# Altium schematic sheet Precharge and TSAL.SchDoc
size Tabloid; SheetNumber: 3; SheetTotal: 4
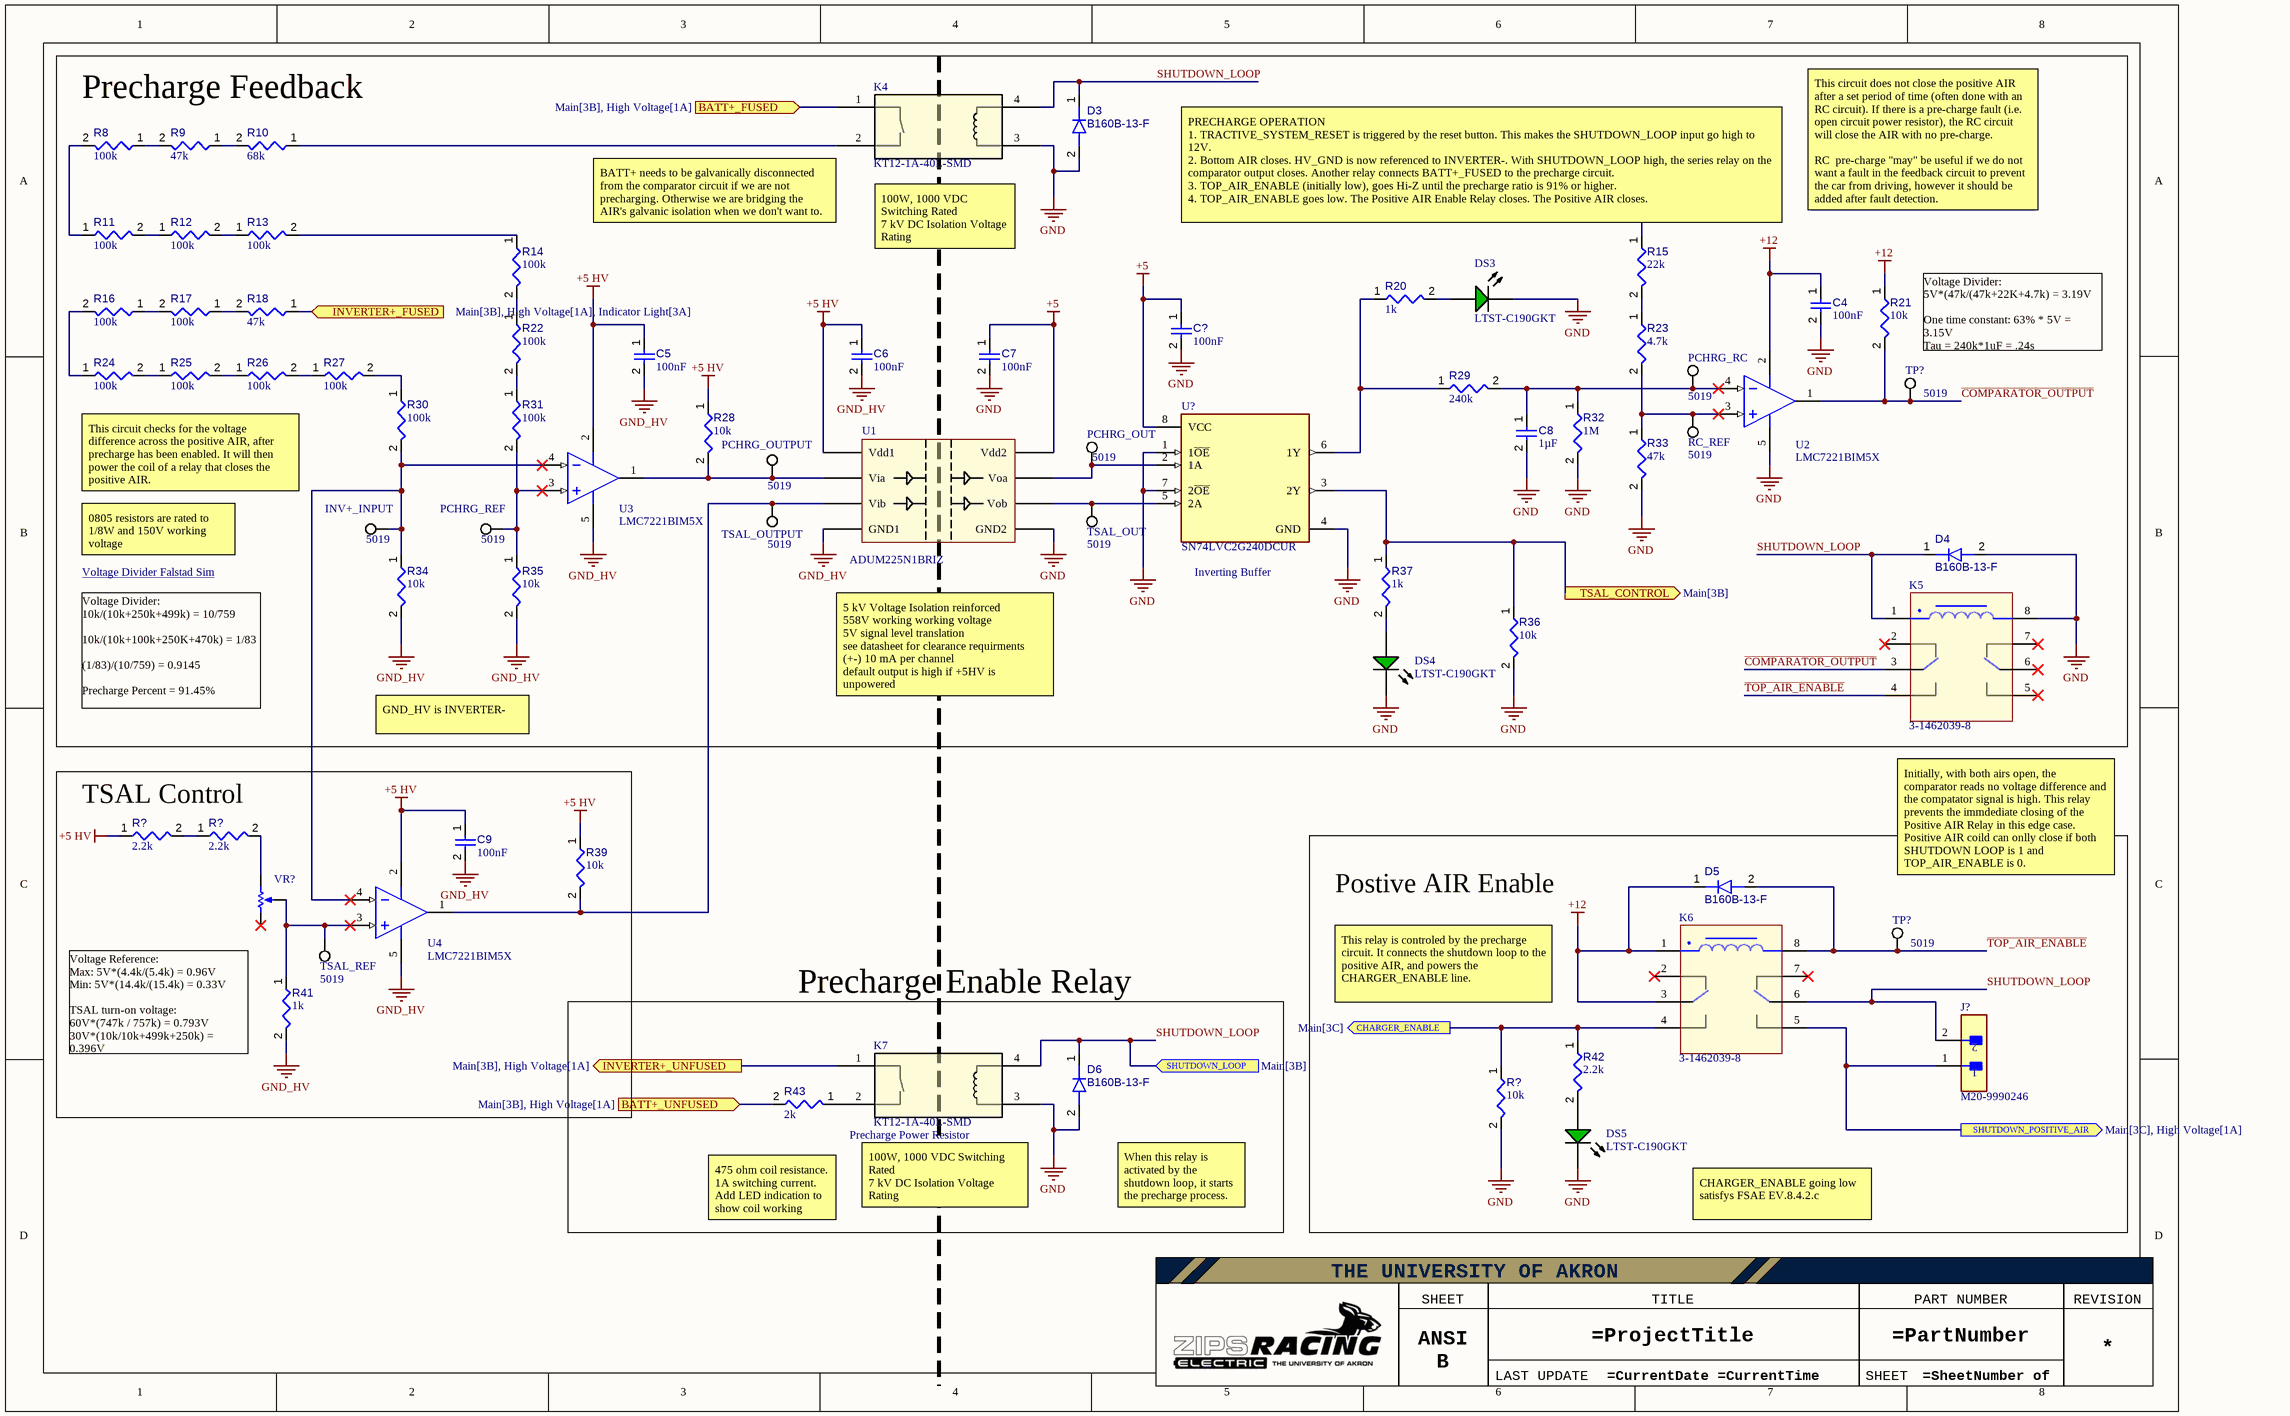
[diagram p0: Precharge and TSAL.SchDoc]

## Parts
(Parts that share a designator on the sheet are numbered #1, #2 ... from top to bottom, then left to right.)
C4  value 100nF  [CAPC1608X90X40NL10T20]  (hidden comment: Capacitor 100 nF +/-10% 50 V 0603)
C5  value 100nF  [CAPC1608X90X40NL10T20]  (hidden comment: Capacitor 100 nF +/-10% 50 V 0603)
C6  value 100nF  [CAPC1608X90X40NL10T20]  (hidden comment: Capacitor 100 nF +/-10% 50 V 0603)
C7  value 100nF  [CAPC1608X90X40NL10T20]  (hidden comment: Capacitor 100 nF +/-10% 50 V 0603)
C8  value 1µF  [CAPC1608X94X35NL15T15]  (hidden comment: Capacitor 1 uF +/- 10% 16 V 0603)
C9  value 100nF  [CAPC1608X90X40NL10T20]  (hidden comment: Capacitor 100 nF +/-10% 50 V 0603)
C?  value 100nF  [CAPC1608X90X40NL10T20]  (hidden comment: Capacitor 100 nF +/-10% 50 V 0603)
D3  B160B-13-F  [FP-SMB-MFG]
D4  B160B-13-F  [FP-SMB-MFG]
D5  B160B-13-F  [FP-SMB-MFG]
D6  B160B-13-F  [FP-SMB-MFG]
DS3  LTST-C190GKT  [LTST-C190GKT_V]
DS4  LTST-C190GKT  [LTST-C190GKT_V]
DS5  LTST-C190GKT  [LTST-C190GKT_V]
INV+_INPUT  5019  [KSTN-5019_V]
J?  M20-9990246  [FP-M20-9990246-MFG]
K4  KT12-1A-40L-SMD  [New footprint 1]
K5  3-1462039-8  [FP-3-1462039-8-MFG]
K6  3-1462039-8  [FP-3-1462039-8-MFG]
K7  KT12-1A-40L-SMD  [New footprint 1]
PCHRG_OUT  5019  [KSTN-5019_V]
PCHRG_OUTPUT  5019  [KSTN-5019_V]
PCHRG_RC  5019  [KSTN-5019_V]
PCHRG_REF  5019  [KSTN-5019_V]
R8  value 100k  [RESC2013X70X40ML20T20]  (hidden comment: Resistor 100k +/-1% 0805 125 mW)
R9  value 47k  [RESC2013X60X35LL10T20]  (hidden comment: Resistor 47k +/- 1 % 0805 125 mW)
R10  value 68k  [RESC2013X70X40NL20T20]  (hidden comment: Resistor 68k +/- 1% 0805 125 mW)
R11  value 100k  [RESC2013X70X40ML20T20]  (hidden comment: Resistor 100k +/-1% 0805 125 mW)
R12  value 100k  [RESC2013X70X40ML20T20]  (hidden comment: Resistor 100k +/-1% 0805 125 mW)
R13  value 100k  [RESC2013X70X40ML20T20]  (hidden comment: Resistor 100k +/-1% 0805 125 mW)
R14  value 100k  [RESC2013X70X40ML20T20]  (hidden comment: Resistor 100k +/-1% 0805 125 mW)
R15  value 22k  [RESC1608X55X25LL10T15]  (hidden comment: Resistor 22k +/- 1% 0603 100 mW)
R16  value 100k  [RESC2013X70X40ML20T20]  (hidden comment: Resistor 100k +/-1% 0805 125 mW)
R17  value 100k  [RESC2013X70X40ML20T20]  (hidden comment: Resistor 100k +/-1% 0805 125 mW)
R18  value 47k  [RESC2013X60X35LL10T20]  (hidden comment: Resistor 47k +/- 1 % 0805 125 mW)
R20  value 1k  [RESC1608X55X25ML10T15]  (hidden comment: Resistor 1k +/-1% 0603 100 mW)
R21  value 10k  [RESC1608X55X25ML10T15]  (hidden comment: Resistor 10k +/-1% 0603 100 mW)
R22  value 100k  [RESC2013X70X40ML20T20]  (hidden comment: Resistor 100k +/-1% 0805 125 mW)
R23  value 4.7k  [RESC1608X55X25ML10T15]  (hidden comment: Resistor 4k7 +/-1% 0603 100 mW)
R24  value 100k  [RESC2013X70X40ML20T20]  (hidden comment: Resistor 100k +/-1% 0805 125 mW)
R25  value 100k  [RESC2013X70X40ML20T20]  (hidden comment: Resistor 100k +/-1% 0805 125 mW)
R26  value 100k  [RESC2013X70X40ML20T20]  (hidden comment: Resistor 100k +/-1% 0805 125 mW)
R27  value 100k  [RESC2013X70X40ML20T20]  (hidden comment: Resistor 100k +/-1% 0805 125 mW)
R28  value 10k  [RESC1608X55X25ML10T15]  (hidden comment: Resistor 10k +/-1% 0603 100 mW)
R29  value 240k  [RESC1608X55X30LL15T15]  (hidden comment: Resistor 240k +/-1% 0603 100 mW)
R30  value 100k  [RESC2013X70X40ML20T20]  (hidden comment: Resistor 100k +/-1% 0805 125 mW)
R31  value 100k  [RESC2013X70X40ML20T20]  (hidden comment: Resistor 100k +/-1% 0805 125 mW)
R32  value 1M  [RESC1608X55X25LL10T15]  (hidden comment: Resistor 1M +/- 1 % 0603 100mW)
R33  value 47k  [FP-RT0603-IPC_C]  (hidden comment: Resistor 47k +/-1% 0603 100 mW)
R34  value 10k  [RESC2013X50X35ML15T15]  (hidden comment: Resistor 10k +/-1% 0805 125 mW)
R35  value 10k  [RESC2013X50X35ML15T15]  (hidden comment: Resistor 10k +/-1% 0805 125 mW)
R36  value 10k  [RESC1608X55X25ML10T15]  (hidden comment: Resistor 10k +/-1% 0603 100 mW)
R37  value 1k  [RESC1608X55X25ML10T15]  (hidden comment: Resistor 1k +/-1% 0603 100 mW)
R39  value 10k  [RESC1608X55X25ML10T15]  (hidden comment: Resistor 10k +/-1% 0603 100 mW)
R41  value 1k  [RESC1608X55X25ML10T15]  (hidden comment: Resistor 1k +/-1% 0603 100 mW)
R42  value 2.2k  [RESC1608X55X25LL10T15]  (hidden comment: Resistor 2.2k +/-1% 0603 100mW)
R43  value 2k  [HSA252K0J-Footprint-1]  (hidden comment: HSA252K0J)
R?#1  value 2.2k  [RESC1608X55X25LL10T15]  (hidden comment: Resistor 2.2k +/-1% 0603 100mW)
R?#2  value 2.2k  [RESC1608X55X25LL10T15]  (hidden comment: Resistor 2.2k +/-1% 0603 100mW)
R?#3  value 10k  [RESC1608X55X25ML10T15]  (hidden comment: Resistor 10k +/-1% 0603 100 mW)
RC_REF  5019  [KSTN-5019_V]
TP?#1  5019  [KSTN-5019_V]
TP?#2  5019  [KSTN-5019_V]
TSAL_OUT  5019  [KSTN-5019_V]
TSAL_OUTPUT  5019  [KSTN-5019_V]
TSAL_REF  5019  [KSTN-5019_V]
U1  ADUM225N1BRIZ  [SOIC127P1030X265-8N]
U2  LMC7221BIM5X  [DBV0005A_L]
U3  LMC7221BIM5X  [DBV0005A_L]
U4  LMC7221BIM5X  [DBV0005A_L]
U?  SN74LVC2G240DCUR  [FP-DCU0008A-IPC_B]
VR?  3362P-1-103LF  [BOUR-3362P]  (value not drawn)

## Blocks framed on the sheet
Precharge Feedback: C4-C8 C? D3 D4 DS3 DS4 INV+_INPUT K4 K5 PCHRG_OUT PCHRG_OUTPUT PCHRG_RC PCHRG_REF R8-R18 R20-R37 RC_REF TP?#1 TSAL_OUT TSAL_OUTPUT U1-U3 U?
TSAL Control: C9 R39 R41 R?#1 R?#2 TSAL_REF U4 VR?
Postive AIR Enable: D5 DS5 J? K6 R42 R?#3 TP?#2
Precharge Enable Relay: D6 K7 R43

## Ports
BATT+_FUSED (in, see Main[3B], High Voltage[1A]), BATT+_UNFUSED (in, see Main[3B], High Voltage[1A]), CHARGER_ENABLE (out, see Main[3C]), INVERTER+_FUSED (in, see Main[3B], High Voltage[1A], Indicator Light[3A]), INVERTER+_UNFUSED (out, see Main[3B], High Voltage[1A]), SHUTDOWN_LOOP (in, see Main[3B]), SHUTDOWN_POSITIVE_AIR (out, see Main[3C], High Voltage[1A]), TSAL_CONTROL (out, see Main[3B])

## Nets
+5: C7.1 C?.1 R15.1 U1.8(Vdd2) U?.8(VCC)
+5 HV: C5.1 C6.1 C9.1 R28.1 R39.1 R?#1.1 U1.1(Vdd1) U3.2(V+) U4.2(V+)
+12: C4.1 D5.1(K) K6.1 K6.3 R21.1 U2.2(V+)
GND: C4.2 C7.2 C8.2 C?.2 D3.2(A) D4.2(A) D6.2(A) DS3.2(K) DS4.2(K) DS5.2(K) K4.3 K5.8 K7.3 R32.2 R33.2 R36.2 R?#3.2 U1.5(GND2) U2.5(V-) U?.1(1~{OE}) U?.4(GND) U?.7(2~{OE})
GND_HV: C5.2 C6.2 C9.2 R34.2 R35.2 R41.2 U1.4(GND1) U3.5(V-) U4.5(V-)
~{COMPARATOR_OUTPUT}: K5.3 R21.2 TP?#1.1 U2.1(OUT)
~{TOP_AIR_ENABLE}: D5.2(A) K5.4 K6.8 TP?#2.1
BATT+_FUSED: K4.1 ; port BATT+_FUSED
BATT+_UNFUSED: R43.2 ; port BATT+_UNFUSED
CHARGER_ENABLE: K6.4 R42.1 R?#3.1 ; port CHARGER_ENABLE
INVERTER+_FUSED: R18.1 ; port INVERTER+_FUSED
INVERTER+_UNFUSED: K7.1 ; port INVERTER+_UNFUSED
SHUTDOWN_LOOP: D3.1(K) D4.1(K) D6.1(K) J?.2 K4.4 K5.1 K6.6 K7.4 ; port SHUTDOWN_LOOP
SHUTDOWN_POSITIVE_AIR: J?.1 K6.5 ; port SHUTDOWN_POSITIVE_AIR
TSAL_CONTROL: R36.1 R37.1 U?.3(2Y) ; port TSAL_CONTROL
NetC8_1: C8.1 PCHRG_RC.1 R29.2 R32.1 U2.4(IN-)
NetDS3_1: DS3.1(A) R20.2
NetDS4_1: DS4.1(A) R37.2
NetDS5_1: DS5.1(A) R42.2
NetINV+_INPUT_1: INV+_INPUT.1 R30.2 R34.1 U3.4(IN-) U4.4(IN-)
NetK4_2: K4.2 R10.1
NetK7_2: K7.2 R43.1
NetPCHRG_OUT_1: PCHRG_OUT.1 U1.7(Voa) U?.2(1A)
NetPCHRG_OUTPUT_1: PCHRG_OUTPUT.1 R28.2 U1.2(Via) U3.1(OUT)
NetPCHRG_REF_1: PCHRG_REF.1 R31.2 R35.1 U3.3(IN+)
NetR8_1: R8.1 R9.2
NetR8_2: R8.2 R11.1
NetR9_1: R9.1 R10.2
NetR11_2: R11.2 R12.1
NetR12_2: R12.2 R13.1
NetR13_2: R13.2 R14.1
NetR14_2: R14.2 R22.1
NetR15_2: R15.2 R23.1
NetR16_1: R16.1 R17.2
NetR16_2: R16.2 R24.1
NetR17_1: R17.1 R18.2
NetR20_1: R20.1 R29.1 U?.6(1Y)
NetR22_2: R22.2 R31.1
NetR23_2: R23.2 R33.1 RC_REF.1 U2.3(IN+)
NetR24_2: R24.2 R25.1
NetR25_2: R25.2 R26.1
NetR26_2: R26.2 R27.1
NetR27_2: R27.2 R30.1
NetR39_2: R39.2 TSAL_OUTPUT.1 U1.3(Vib) U4.1(OUT)
NetR41_1: R41.1 TSAL_REF.1 U4.3(IN+) VR?.2(S)
NetR?#1_2: R?#1.2 R?#2.1
NetR?#2_2: R?#2.2 VR?.3(CW)
NetTSAL_OUT_1: TSAL_OUT.1 U1.6(Vob) U?.5(2A)

Not connected (* = marked no-connect by the designer): K5 2* 5* 6* 7*; K6 2* 7*; VR? 1(CCW)*

## Notes on the sheet
- (near K4) BATT+ needs to be galvanically disconnected from the comparator circuit if we are not precharging. Otherwise we are bridging the AIR's galvanic isolation when we don't want to.
- (near R15) PRECHARGE OPERATION
  1. TRACTIVE_SYSTEM_RESET is triggered by the reset button. This makes the SHUTDOWN_LOOP input go high to 12V.
  2. Bottom AIR closes. HV_GND is now referenced to INVERTER-. With SHUTDOWN_LOOP high, the series relay on the comparator output closes. Another relay connects BATT+_FUSED to the precharge circuit.
  3. TOP_AIR_ENABLE (initially low), goes Hi-Z until the precharge ratio is 91% or higher.
  4. TOP_AIR_ENABLE goes low. The Positive AIR Enable Relay closes. The Positive AIR closes.
  Notes: all relays stay closed during driving and until the shutdown loop opens.
- This circuit does not close the positive AIR after a set period of time (often done with an RC circuit). If there is a pre-charge fault (i.e. open circuit power resistor), the RC circuit will close the AIR with no pre-charge.
  RC  pre-charge "may" be useful if we do not want a fault in the feedback circuit to prevent the car from driving, however it should be added after fault detection.
- (near K4) 100W, 1000 VDC Switching Rated
  7 kV DC Isolation Voltage Rating
- Voltage Divider:
  5V*(47k/(47k+22K+4.7k) = 3.19V
  One time constant: 63% * 5V = 3.15V
  Tau = 240k*1uF = .24s
- This circuit checks for the voltage difference across the positive AIR, after precharge has been enabled. It will then power the coil of a relay that closes the positive AIR.
- Voltage Divider Falstad Sim <https://tinyurl.com/ywocnskm>
- 0805 resistors are rated to 1/8W and 150V working voltage
- (near U?) Inverting Buffer
- Voltage Divider:
  10k/(10k+250k+499k) = 10/759
  10k/(10k+100k+250K+470k) = 1/83
  (1/83)/(10/759) = 0.9145
  Precharge Percent = 91.45%
- GND_HV is INVERTER-
- 5 kV Voltage Isolation reinforced
  558V working working voltage
  5V signal level translation
  see datasheet for clearance requirments
  (+-) 10 mA per channel
  default output is high if +5HV is unpowered
- Initially, with both airs open, the comparator reads no voltage difference and the compatator signal is high. This relay prevents the immdediate closing of the Positive AIR Relay in this edge case. Positive AIR coild can onlly close if both SHUTDOWN LOOP is 1 and TOP_AIR_ENABLE is 0.
- Voltage Reference:
  Max: 5V*(4.4k/(5.4k) = 0.96V
  Min: 5V*(14.4k/(15.4k) = 0.33V
  TSAL turn-on voltage:
  60V*(747k / 757k) = 0.793V
  30V*(10k/10k+499k+250k) = 0.396V
- This relay is controled by the precharge circuit. It connects the shutdown loop to the positive AIR, and powers the CHARGER_ENABLE line.
- Precharge Power Resistor
- 475 ohm coil resistance. 1A switching current. Add LED indication to show coil working
- 100W, 1000 VDC Switching Rated
  7 kV DC Isolation Voltage Rating
- When this relay is activated by the shutdown loop, it starts the precharge process.
- CHARGER_ENABLE going low satisfys FSAE EV.8.4.2.c
- THE UNIVERSITY OF AKRON
- SHEET SIZE
- TITLE
- PART NUMBER
- REVISION
- ANSI B
- LAST UPDATE
- SHEET
- (in symbol CMP-008-00010-2) .

## Library data of the parts
C4-C7 C9 C? = CMP-001-00017-6: Chip Capacitor, 100 nF, +/- 10%, 50 V, 0603 (1608 Metric); Voltage Rating: 50V; Capacitor Type: Ceramic; Tolerance: 10%; Mounting Technology: SM; Max Operating Temperature: 125°C; RoHS Compliant: True; Pins: 2; Case/Package: 0603; Min Operating Temperature: -55°C
C8 = CMP-001-00003-6: Chip Capacitor, 1 uF, +/- 10%, 16 V, 0603 (1608 Metric); Voltage Rating: 16V; Capacitor Type: Ceramic; Max Operating Temperature: 125°C; Pins: 2; Tolerance: 10%; Min Operating Temperature: -55°C; RoHS Compliant: True; Mounting Technology: SM; Case/Package: 0603
D3-D6 = CMP-004-00032-1: Rectifier Diode, Schottky, 1 Phase, 1 Element, 1A, 60V V(RRM), Silicon; Forward Voltage: 700mV; Qualification Status: Not Qualified; RoHS Compliant: Yes; Surface Mount: Yes; Max Operating Temperature: 150°C; Max Output current: 1A; Min Operating Temperature: -65°C; Technology: SCHOTTKY; Pins: 2
DS3-DS5 = CMP-007-00022-2: LED Uni-Color Green, 100 mW, 30 mA, -55 to 85 degC, 2-Pin SMD, RoHS, Tape and Reel; Manufacturer: Lite-On; Power: 100mW; Forward Voltage: 2.1V; Viewing Angle: 130degrees; Forward Current: 20mA; Luminous Intensity: 6mcd; Lens Style: Clear; Manufacturer URL: http://www.us.liteon.com/; RoHS Compliant: True; Colour: Green; Package Description: 2-Pin Surface Mount Device, Body 1.6 x 0.8 mm; Datasheet URL: http://datasheet.octopart.com/LTST-C190GKT-Lite-On-datasheet-158530.pdf; Datasheet Version: Dec-06; Mounting Technology: SM; Case/Package: 0603; Package Reference: C190GKT; Packaging: TapeandReel; Min Operating Temperature: -55°C; Nominal Vf: 2.1V; Package Quantity: 3000; Illumination Colour: Green; Max Operating Temperature: 85°C; Pins: 2
INV+_INPUT PCHRG_OUT PCHRG_OUTPUT PCHRG_RC PCHRG_REF RC_REF TP?#1 TP?#2 TSAL_OUT TSAL_OUTPUT TSAL_REF = CMP-00012-1: Interconnection Device
J? = CMP-00030-00002-1: Board Connector, 2 Contact(s), 1 Row(s), Male, Straight, 0.1 inch Pitch, Solder Terminal, Locking, Black Insulator; Number of Contacts: 2; Min Operating Temperature: -40°C; RoHS Compliant: Yes; Max Operating Temperature: 105°C; Mounting Technology: Board; Terminal Pitch: 2.54mm
K4 K7 = CMP-008-00007-2: Reed Relay 12VDC 475Ohm 1A SPST-NO(30.2x17x8.7)mm SMD Dry Automotive; Coil Current: 25mA; Coil Resistance: 475R; Coil Power: 303mW; Height: 8.7mm; Max Operating Temperature: 100°C; Case/Package: SMD/SMT; ComponentLink1URL: https://4a30d8fd18dae1bf393d-df49f4cedb726ad03ad145d2e3d346bd.ssl.cf5.rackcdn.com/datasheets/90/9012185401e.pdf; ComponentLink1Description: Datasheet
K5 K6 = CMP-008-00010-2: Power/Signal Relay, 2 Form C, DPDT, Momentary, 0.01A (Coil), 12VDC (Coil), 140mW (Coil), 5A (Contact), 220VDC (Contact), DC Input, Random, AC/DC Output, Through Hole-Straight Mount; Operate Time: 3ms; Contact Form: DPDT; RoHS Compliant: Yes; ComponentLink1URL: https://www.te.com/commerce/DocumentDelivery/DDEController?Action=srchrtrv&DocNm=108-98001&DocType=Data+Sheet&DocLang=English&DocFormat=pdf&PartCntxt=3-1462039-8; Min Operating Temperature: -40°C; Pins: 8; ComponentLink1Description: Datasheet; Max Operating Temperature: 85°C; Current Rating: 5A; Mounting Technology: Through-hole
R8 R11-R14 R16 R17 R22 R24-R27 R30 R31 = CMP-009-00024-5: Chip Resistor, 100 KOhm, +/- 1%, 0.125 W, -55 to 155 degC, 0805 (2012 Metric); Power: 125mW; Voltage Rating: 150V; Max Operating Temperature: 155°C; Mounting Technology: SM; RoHS Compliant: True; Tolerance: 1%; Case/Package: 0805; Min Operating Temperature: -55°C; Pins: 2
R9 R18 = CMP-009-00276-2: Fixed Resistor, Metal Glaze/thick Film, 0.125W, 47000ohm, 150V, 1% +/-Tol, 100ppm/Cel, Surface Mount, 0805; Temperature Coefficient: 100ppm/°C; Power: 125mW; Rated Temperature: 70°C; Tolerance: 1%; Pins: 2; Case/Package: 0805; Mounting Technology: Surface Mount; Min Operating Temperature: -55°C; Max Operating Temperature: 155°C; RoHS Compliant: Yes; Working Voltage: 150V
R10 = CMP-009-00277-1: Fixed Resistor, Metal Glaze/thick Film, 0.125W, 68000ohm, 150V, 1% +/-Tol, 100ppm/Cel, Surface Mount, 0805; Temperature Coefficient: 100ppm/°C; Rated Temperature: 70°C; Power: 125mW; RoHS Compliant: Yes; Tolerance: 1%; Mounting Technology: Surface Mount; Max Operating Temperature: 155°C; Pins: 2; Case/Package: 0805; Min Operating Temperature: -55°C; Working Voltage: 150V
R15 = CMP-009-00278-1: Fixed Resistor, Metal Glaze/thick Film, 0.1W, 22000ohm, 75V, 1% +/-Tol, 100ppm/Cel, Surface Mount, 0603; Power: 100mW; Rated Temperature: 70°C; Temperature Coefficient: 100ppm/°C; Pins: 2; RoHS Compliant: Yes; Max Operating Temperature: 155°C; Tolerance: 1%; Case/Package: 0603; Working Voltage: 75V; Min Operating Temperature: -55°C; Mounting Technology: Surface Mount
R20 R37 R41 = CMP-009-00014-5: Chip Resistor, 1 KOhm, +/-1%, 0.1 W, -55 to 155 degC, 0603 (1608 Metric); Voltage Rating: 50V; Power: 100mW; Tolerance: 1%; Mounting Technology: SM; Pins: 2; Case/Package: 0603; Min Operating Temperature: -55°C; RoHS Compliant: True; Max Operating Temperature: 155°C
R21 R28 R36 R39 R?#3 = CMP-009-00017-5: Chip Resistor, 10 KOhm, +/- 1%, 01 W, -55 to 155 degC, 0603 (1608 Metric); Voltage Rating: 50V; Power: 100mW; RoHS Compliant: True; Min Operating Temperature: -55°C; Pins: 2; Case/Package: 0603; Mounting Technology: SM; Max Operating Temperature: 155°C; Tolerance: 1%
R23 = CMP-009-00031-5: Chip Resistor, 4.7 KOhm, +/- 1%, 0.1 W, -55 to 155 degC, 0603 (1608 Metric); Power: 100mW; Tolerance: 1%; Mounting Technology: SM; Case/Package: 0603; RoHS Compliant: True; Pins: 2; Min Operating Temperature: -55°C; Max Operating Temperature: 155°C
R29 = CMP-009-00280-1: Fixed Resistor, Metal Glaze/thick Film, 0.1W, 240000ohm, 75V, 1% +/-Tol, 100ppm/Cel, Surface Mount, 0603; Temperature Coefficient: 100ppm/°C; Rated Temperature: 70°C; Power: 100mW; RoHS Compliant: Yes; Working Voltage: 75V; Case/Package: 0603; Mounting Technology: Surface Mount; Max Operating Temperature: 155°C; Min Operating Temperature: -55°C; Pins: 2; Tolerance: 1%
R32 = CMP-009-00279-1: Fixed Resistor, Metal Glaze/thick Film, 0.1W, 1000000ohm, 75V, 1% +/-Tol, 100ppm/Cel, Surface Mount, 0603; Temperature Coefficient: 100ppm/°C; Rated Temperature: 70°C; RoHS Compliant: Yes; Tolerance: 1%; Max Operating Temperature: 155°C; Power: 100mW; Pins: 2; Working Voltage: 75V; Min Operating Temperature: -55°C; Mounting Technology: Surface Mount; Case/Package: 0603
R33 = CMP-009-00281-1: Fixed Resistor, Thin Film, 0.1W, 47000ohm, 75V, 1% +/-Tol, 50ppm/Cel, Surface Mount, 0603; Rated Temperature: 70°C; Temperature Coefficient: 50ppm/°C; Power: 100mW; Min Operating Temperature: -55°C; Max Operating Temperature: 155°C; Case/Package: 0603; Tolerance: 1%; Working Voltage: 75V; RoHS Compliant: Yes; Mounting Technology: Surface Mount; Pins: 2
R34 R35 = CMP-009-00018-5: Chip Resistor, 10 KOhm, +/- 1%, 125 mW, -55 to 155 degC, 0805 (2012 Metric); Power: 125mW; Voltage Rating: 150V; Tolerance: 1%; Pins: 2; Min Operating Temperature: -55°C; Case/Package: 0805; Max Operating Temperature: 155°C; RoHS Compliant: True; Mounting Technology: SM
R42 R?#1 R?#2 = CMP-009-00198-1: Description Chip Resistor, 2.2 KOhm, +/-1%, 0.1 W, -55 to 155 degC, 0603 (1608 Metric); Temperature Coefficient: 100ppm/°C; Rated Temperature: 70°C; Tolerance: 1%; Working Voltage: 75V; Case/Package: 0603; Power: 100mW; Mounting Technology: Surface Mount; Min Operating Temperature: -55°C; Max Operating Temperature: 155°C; RoHS Compliant: Yes; Pins: 2
R43 = CMP-009-00275-1: Fixed Resistor, Wire Wound, 25W, 2000ohm, 550V, 5% +/-Tol, 30ppm/Cel, Chassis Mount; Package Height: 15mm; Package Width: 28mm; Package Length: 29mm; Temperature Coefficient: 30ppm/°C; Power: 25W; Tolerance: 5%; Working Voltage: 550V; RoHS Compliant: Yes; Pins: 2
U1 = CMP-015-00008-2: Analog Circuit, 1 Func, CMOS, PDSO8; Max Supply Voltage: 5V; Min Supply Voltage: 1.7V; Nominal Supply Voltage: 1.8V; Surface Mount: Yes; Max Operating Temperature: 125°C; Case/Package: SOP; Temperature Grade: AUTOMOTIVE; RoHS Compliant: Yes; Technology: CMOS; Min Operating Temperature: -40°C; Pins: 8
U2-U4 = CMP-016-00012-2: Tiny CMOS Comparator with ail-to- ail Input and Open Drain Output 5-SOT-23 -40 to 85; Output Type: OPEN-DRAIN; Nominal Supply Voltage: 5V; Power Supplies: 2.7/15V; RoHS Compliant: No; Pins: 5; Case/Package: LSSOP; Technology: CMOS; Min Operating Temperature: -40°C; Surface Mount: Yes; Amplifier Type: COMPARATOR; Max Operating Temperature: 85°C
U? = CMP-016-00022-1: Bus Driver, LVC/LCX/Z Series, 2-Func, 1-Bit, Inverted Output, CMOS, PDSO8; Nominal Supply Voltage: 3.3V; Min Supply Voltage: 1.65V; Max Supply Voltage: 5.5V; RoHS Compliant: Yes; Min Operating Temperature: -40°C; Logic Type: BUS DRIVER; Case/Package: VSSOP; Max Operating Temperature: 125°C; Pins: 8
VR? = CMP-009-00039-2: Square Trimpot(R) Trimming Potentiometer, 10 KOhm, 300 V, -55 to 125 degC, 3-Pin THD, RoHS, Tube; Manufacturer: Bourns; Tolerance: 10%; Power: 500mW; Voltage Rating: 300V; Resistance: 10k; Packaging: Rail/Tube; Package Reference: 3326P; Manufacturer URL: http://www.bourns.com/; Composition: Potentiometer; Package Description: 3-Pin Through Hole Device, Body 6.6 x 6.99 mm, Pitch 2.54 mm; Max Operating Temperature: 125°C; Min Operating Temperature: -55°C; Datasheet Version: May-16; Lead Pitch: 2.54mm; Pins: 3; Datasheet URL: http://www.bourns.com/docs/Product-Datasheets/3362.pdf; Package Quantity: 250; Case/Package: 3326P; RoHS Compliant: True; Mounting Technology: TH